# EAGLE schematic BMSBoard (EAGLE 9.1.3)
Steps for Daisy Chaining: Check pins: COMMH+, COMMH-, COMML+, COMML- FAULT_N, FAULTH+, FAULTH-, FAULTL+, FAULTL- VIO _ Connect pins as described.
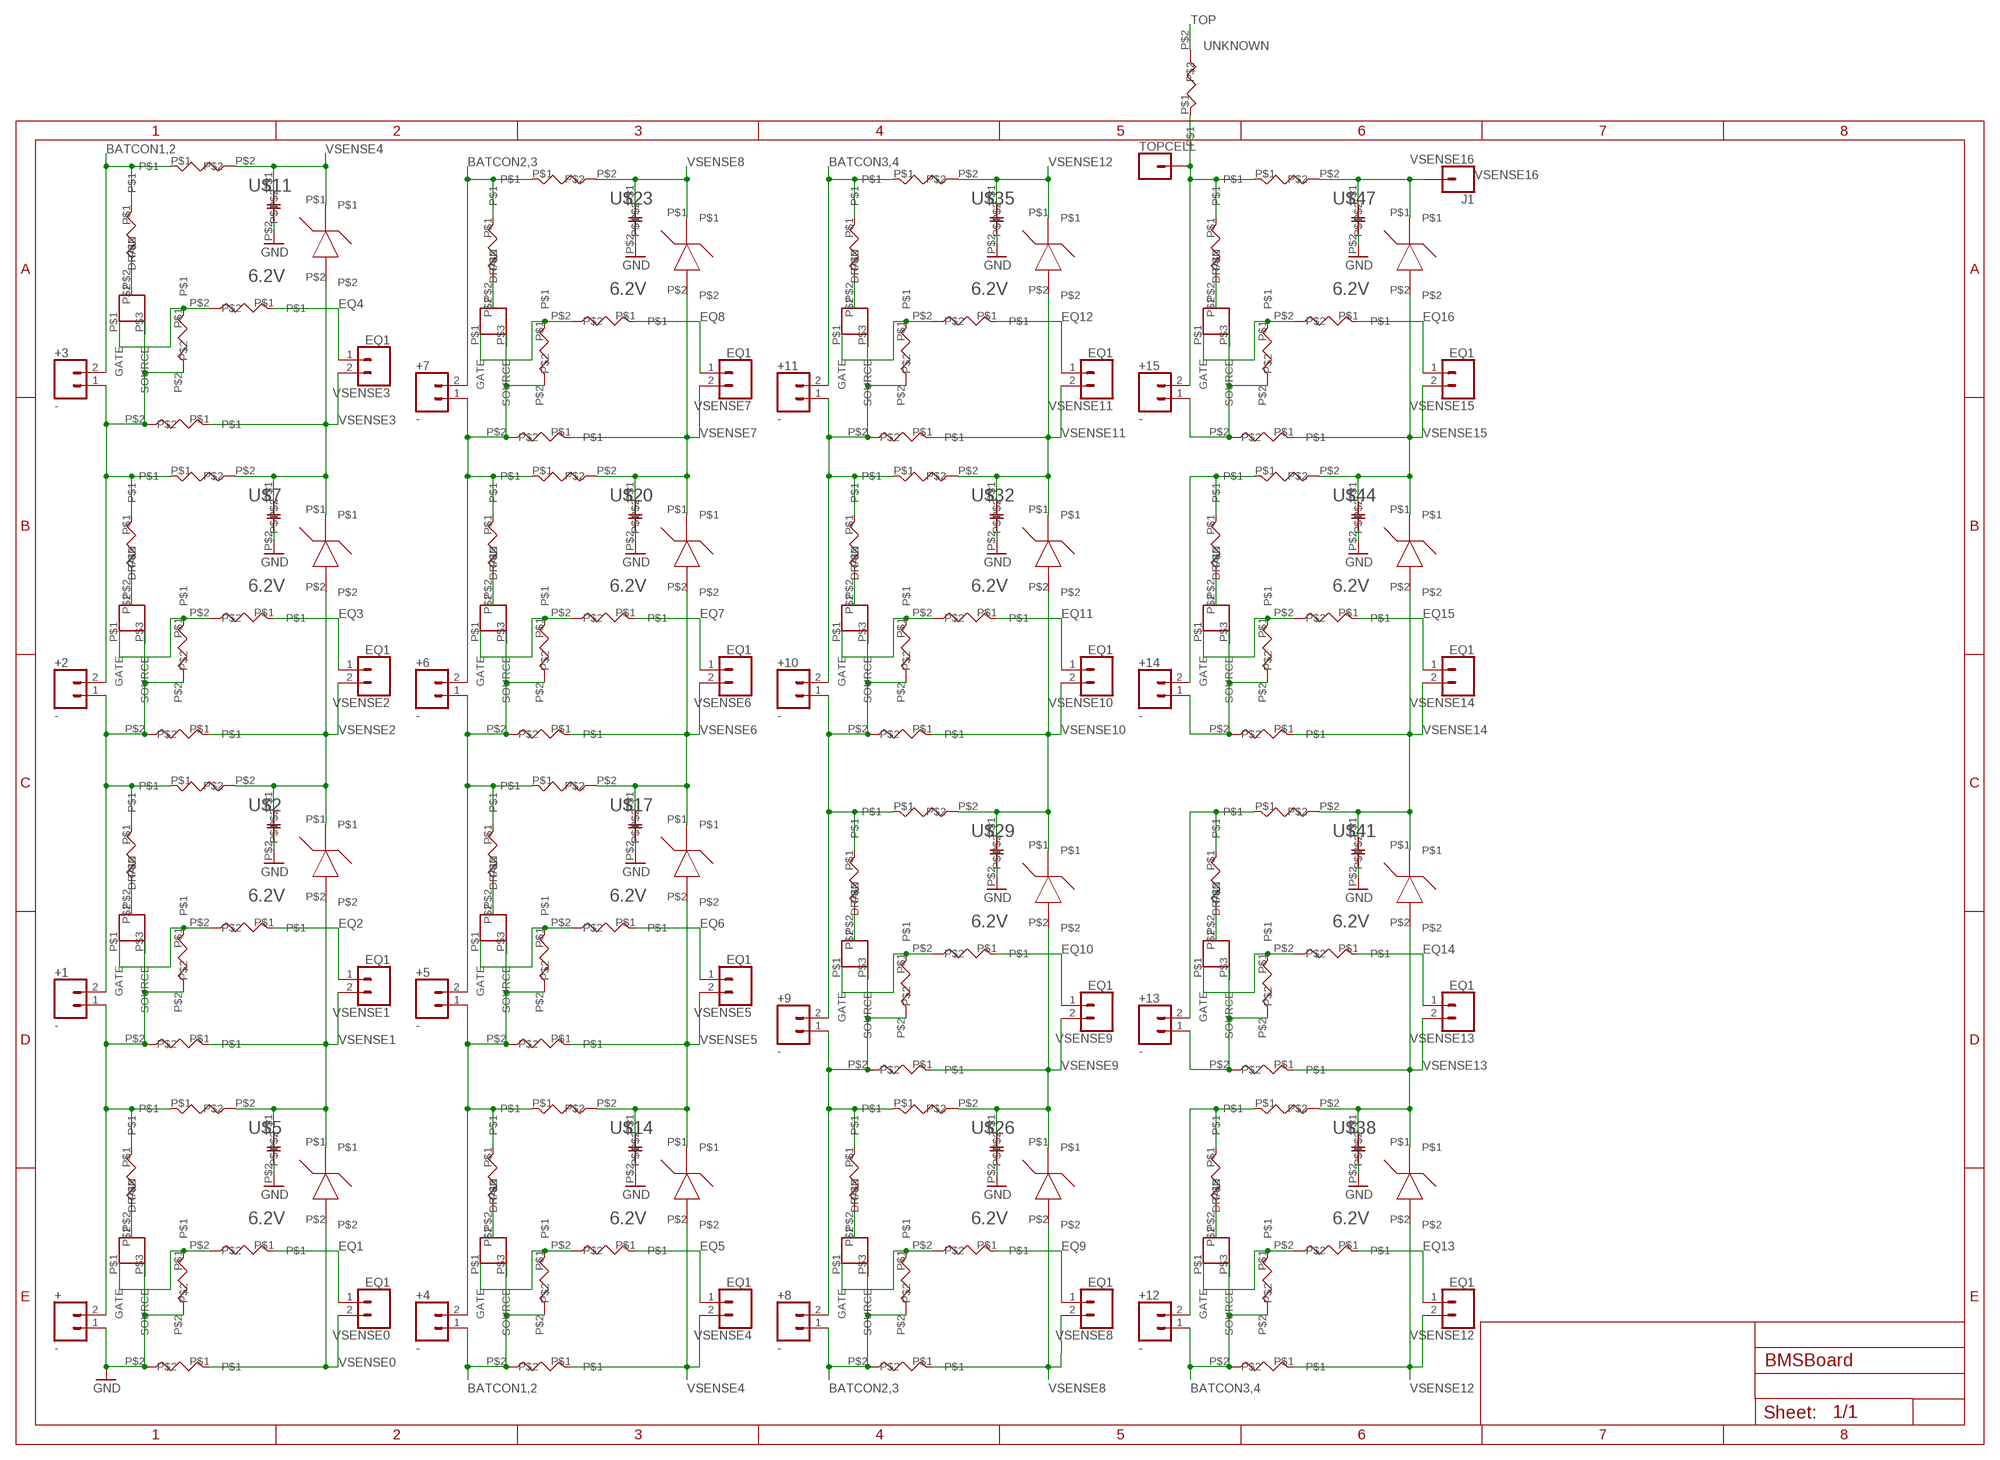
[diagram p0: schematic, sheet 1, part 1 of 2]
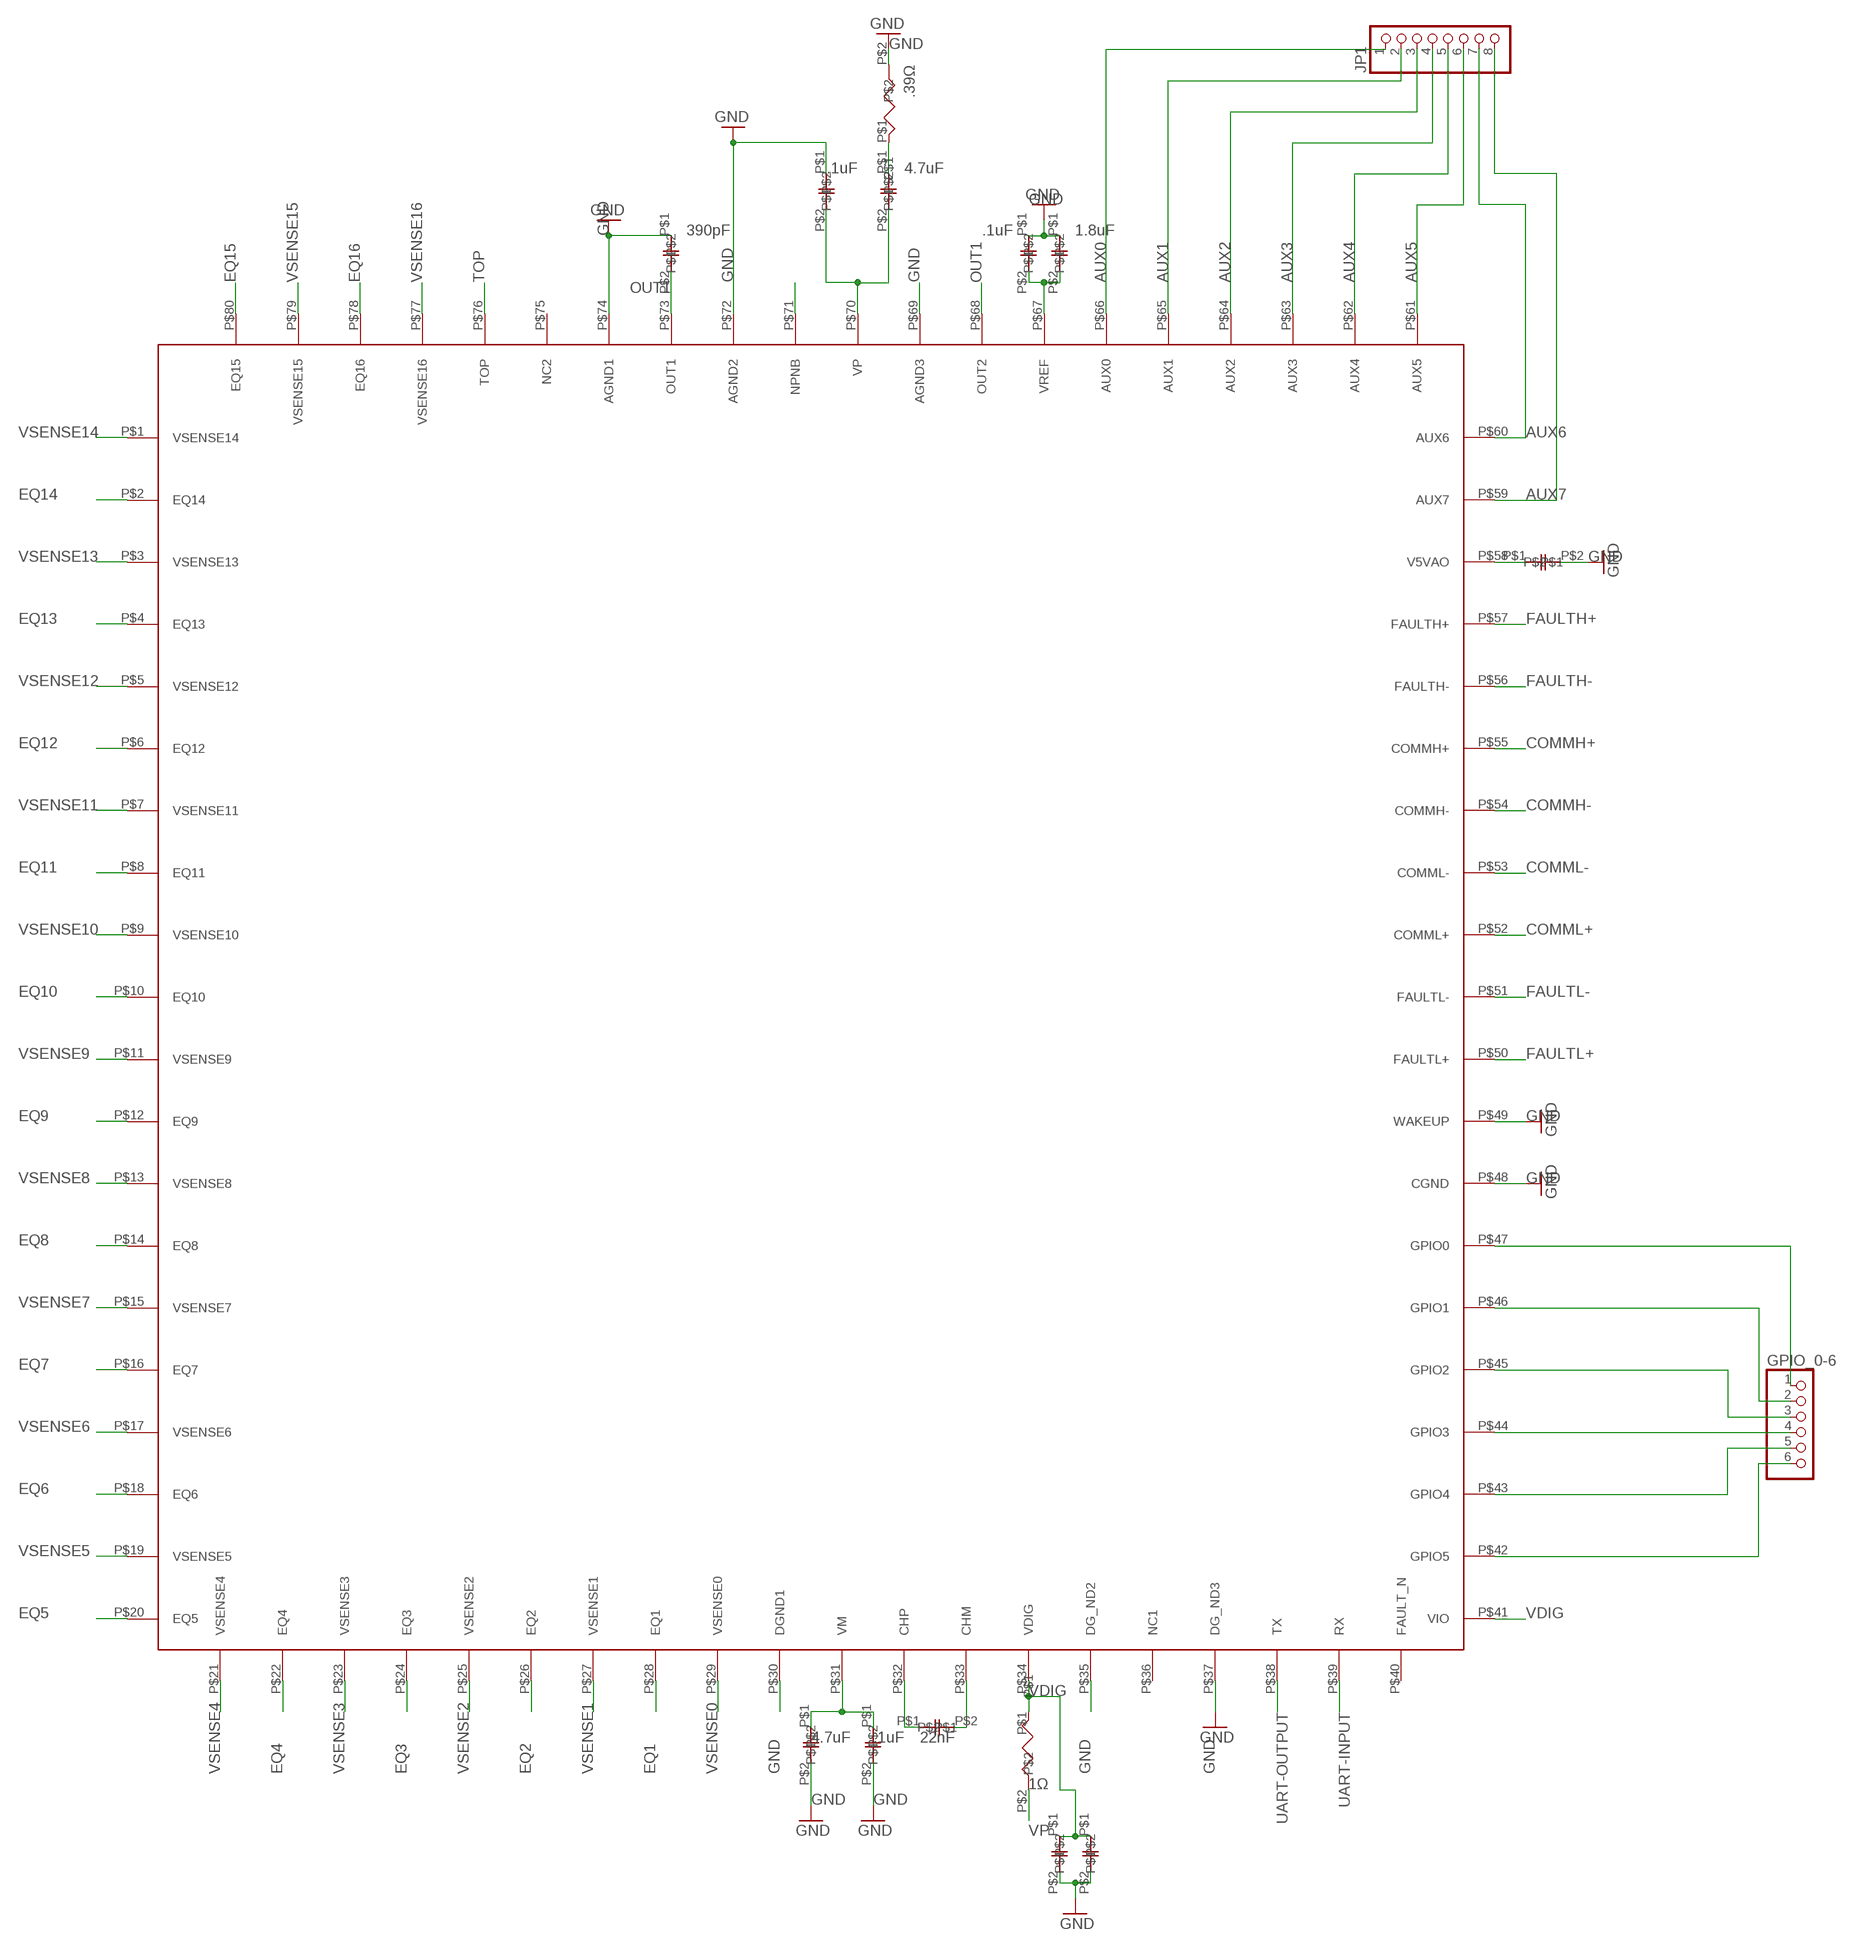
[diagram p1: schematic, sheet 1, part 2 of 2]

## Parts
1UF  1uF  CL21B105KBFNNNG  [CL21B105KBFNNNG]
1UF1  1uF  CL21B105KBFNNNG  [CL21B105KBFNNNG]
1UF2  1uF  CL21B105KBFNNNG  [CL21B105KBFNNNG]
1UF3  1uF  CL21B105KBFNNNG  [CL21B105KBFNNNG]
1UF4  1uF  CL21B105KBFNNNG  [CL21B105KBFNNNG]
1UF5  1uF  CL21B105KBFNNNG  [CL21B105KBFNNNG]
1UF6  1uF  CL21B105KBFNNNG  [CL21B105KBFNNNG]
1UF7  1uF  CL21B105KBFNNNG  [CL21B105KBFNNNG]
1UF8  1uF  CL21B105KBFNNNG  [CL21B105KBFNNNG]
1UF9  1uF  CL21B105KBFNNNG  [CL21B105KBFNNNG]
1UF10  1uF  CL21B105KBFNNNG  [CL21B105KBFNNNG]
1UF11  1uF  CL21B105KBFNNNG  [CL21B105KBFNNNG]
1UF12  1uF  CL21B105KBFNNNG  [CL21B105KBFNNNG]
1UF13  1uF  CL21B105KBFNNNG  [CL21B105KBFNNNG]
1UF14  1uF  CL21B105KBFNNNG  [CL21B105KBFNNNG]
1UF15  1uF  CL21B105KBFNNNG  [CL21B105KBFNNNG]
2KΩ  2kΩ  PWR3014W1000JE  [PWR3014W1000JE]
2KΩ1  2kΩ  PWR3014W1000JE  [PWR3014W1000JE]
2KΩ2  2kΩ  PWR3014W1000JE  [PWR3014W1000JE]
2KΩ3  2kΩ  PWR3014W1000JE  [PWR3014W1000JE]
2KΩ4  2kΩ  PWR3014W1000JE  [PWR3014W1000JE]
2KΩ5  2kΩ  PWR3014W1000JE  [PWR3014W1000JE]
2KΩ6  2kΩ  PWR3014W1000JE  [PWR3014W1000JE]
2KΩ7  2kΩ  PWR3014W1000JE  [PWR3014W1000JE]
2KΩ8  2kΩ  PWR3014W1000JE  [PWR3014W1000JE]
2KΩ9  2kΩ  PWR3014W1000JE  [PWR3014W1000JE]
2KΩ10  2kΩ  PWR3014W1000JE  [PWR3014W1000JE]
2KΩ11  2kΩ  PWR3014W1000JE  [PWR3014W1000JE]
2KΩ12  2kΩ  PWR3014W1000JE  [PWR3014W1000JE]
2KΩ13  2kΩ  PWR3014W1000JE  [PWR3014W1000JE]
2KΩ14  2kΩ  PWR3014W1000JE  [PWR3014W1000JE]
2KΩ15  2kΩ  PWR3014W1000JE  [PWR3014W1000JE]
75Ω  75Ω  PWR3014W1000JE  [PWR3014W1000JE]
75Ω1  75Ω  PWR3014W1000JE  [PWR3014W1000JE]
75Ω2  75Ω  PWR3014W1000JE  [PWR3014W1000JE]
75Ω3  75Ω  PWR3014W1000JE  [PWR3014W1000JE]
75Ω4  75Ω  PWR3014W1000JE  [PWR3014W1000JE]
75Ω5  75Ω  PWR3014W1000JE  [PWR3014W1000JE]
75Ω6  75Ω  PWR3014W1000JE  [PWR3014W1000JE]
75Ω7  75Ω  PWR3014W1000JE  [PWR3014W1000JE]
75Ω8  75Ω  PWR3014W1000JE  [PWR3014W1000JE]
75Ω9  75Ω  PWR3014W1000JE  [PWR3014W1000JE]
75Ω10  75Ω  PWR3014W1000JE  [PWR3014W1000JE]
75Ω11  75Ω  PWR3014W1000JE  [PWR3014W1000JE]
75Ω12  75Ω  PWR3014W1000JE  [PWR3014W1000JE]
75Ω13  75Ω  PWR3014W1000JE  [PWR3014W1000JE]
75Ω14  75Ω  PWR3014W1000JE  [PWR3014W1000JE]
75Ω15  75Ω  PWR3014W1000JE  [PWR3014W1000JE]
100KΩ  100kΩ  PWR3014W1000JE  [PWR3014W1000JE]
100KΩ1  100kΩ  PWR3014W1000JE  [PWR3014W1000JE]
100KΩ2  100kΩ  PWR3014W1000JE  [PWR3014W1000JE]
100KΩ3  100kΩ  PWR3014W1000JE  [PWR3014W1000JE]
100KΩ4  100kΩ  PWR3014W1000JE  [PWR3014W1000JE]
100KΩ5  100kΩ  PWR3014W1000JE  [PWR3014W1000JE]
100KΩ6  100kΩ  PWR3014W1000JE  [PWR3014W1000JE]
100KΩ7  100kΩ  PWR3014W1000JE  [PWR3014W1000JE]
100KΩ8  100kΩ  PWR3014W1000JE  [PWR3014W1000JE]
100KΩ9  100kΩ  PWR3014W1000JE  [PWR3014W1000JE]
100KΩ10  100kΩ  PWR3014W1000JE  [PWR3014W1000JE]
100KΩ11  100kΩ  PWR3014W1000JE  [PWR3014W1000JE]
100KΩ12  100kΩ  PWR3014W1000JE  [PWR3014W1000JE]
100KΩ13  100kΩ  PWR3014W1000JE  [PWR3014W1000JE]
100KΩ14  100kΩ  PWR3014W1000JE  [PWR3014W1000JE]
100KΩ15  100kΩ  PWR3014W1000JE  [PWR3014W1000JE]
100Ω  100Ω  PWR3014W1000JE  [PWR3014W1000JE]
100Ω1  100Ω  PWR3014W1000JE  [PWR3014W1000JE]
100Ω2  100Ω  PWR3014W1000JE  [PWR3014W1000JE]
100Ω3  100Ω  PWR3014W1000JE  [PWR3014W1000JE]
100Ω4  100Ω  PWR3014W1000JE  [PWR3014W1000JE]
100Ω5  100Ω  PWR3014W1000JE  [PWR3014W1000JE]
100Ω6  100Ω  PWR3014W1000JE  [PWR3014W1000JE]
100Ω7  100Ω  PWR3014W1000JE  [PWR3014W1000JE]
100Ω8  100Ω  PWR3014W1000JE  [PWR3014W1000JE]
100Ω9  100Ω  PWR3014W1000JE  [PWR3014W1000JE]
100Ω10  100Ω  PWR3014W1000JE  [PWR3014W1000JE]
100Ω11  100Ω  PWR3014W1000JE  [PWR3014W1000JE]
100Ω12  100Ω  PWR3014W1000JE  [PWR3014W1000JE]
100Ω13  100Ω  PWR3014W1000JE  [PWR3014W1000JE]
100Ω14  100Ω  PWR3014W1000JE  [PWR3014W1000JE]
100Ω15  100Ω  PWR3014W1000JE  [PWR3014W1000JE]
+  -  CONN_02  [1X02]
+1  -  CONN_02  [1X02]
+2  -  CONN_02  [1X02]
+3  -  CONN_02  [1X02]
+4  -  CONN_02  [1X02]
+5  -  CONN_02  [1X02]
+6  -  CONN_02  [1X02]
+7  -  CONN_02  [1X02]
+8  -  CONN_02  [1X02]
+9  -  CONN_02  [1X02]
+10  -  CONN_02  [1X02]
+11  -  CONN_02  [1X02]
+12  -  CONN_02  [1X02]
+13  -  CONN_02  [1X02]
+14  -  CONN_02  [1X02]
+15  -  CONN_02  [1X02]
GPIO_0-6  PINHD-1X6  [1X06]
J1  VSENSE16  CONN_01  [1X01]
JP1  PINHD-1X8BIG  [1X08-BIG]
TOPCELL  CONN_01  [1X01]
U$1  2V7002KT1G  [2V7002KT1G]
U$2  6.2V  PDZ6.2BGWX  [SOD-123-2]
U$3  100Ω  PWR3014W1000JE  [PWR3014W1000JE]
U$4  2V7002KT1G  [2V7002KT1G]
U$5  6.2V  PDZ6.2BGWX  [SOD-123-2]
U$6  2V7002KT1G  [2V7002KT1G]
U$7  6.2V  PDZ6.2BGWX  [SOD-123-2]
U$8  100Ω  PWR3014W1000JE  [PWR3014W1000JE]
U$9  100Ω  PWR3014W1000JE  [PWR3014W1000JE]
U$10  2V7002KT1G  [2V7002KT1G]
U$11  6.2V  PDZ6.2BGWX  [SOD-123-2]
U$12  100Ω  PWR3014W1000JE  [PWR3014W1000JE]
U$13  2V7002KT1G  [2V7002KT1G]
U$14  6.2V  PDZ6.2BGWX  [SOD-123-2]
U$15  100Ω  PWR3014W1000JE  [PWR3014W1000JE]
U$16  2V7002KT1G  [2V7002KT1G]
U$17  6.2V  PDZ6.2BGWX  [SOD-123-2]
U$18  100Ω  PWR3014W1000JE  [PWR3014W1000JE]
U$19  2V7002KT1G  [2V7002KT1G]
U$20  6.2V  PDZ6.2BGWX  [SOD-123-2]
U$21  100Ω  PWR3014W1000JE  [PWR3014W1000JE]
U$22  2V7002KT1G  [2V7002KT1G]
U$23  6.2V  PDZ6.2BGWX  [SOD-123-2]
U$24  100Ω  PWR3014W1000JE  [PWR3014W1000JE]
U$25  2V7002KT1G  [2V7002KT1G]
U$26  6.2V  PDZ6.2BGWX  [SOD-123-2]
U$27  100Ω  PWR3014W1000JE  [PWR3014W1000JE]
U$28  2V7002KT1G  [2V7002KT1G]
U$29  6.2V  PDZ6.2BGWX  [SOD-123-2]
U$30  100Ω  PWR3014W1000JE  [PWR3014W1000JE]
U$31  2V7002KT1G  [2V7002KT1G]
U$32  6.2V  PDZ6.2BGWX  [SOD-123-2]
U$33  100Ω  PWR3014W1000JE  [PWR3014W1000JE]
U$34  2V7002KT1G  [2V7002KT1G]
U$35  6.2V  PDZ6.2BGWX  [SOD-123-2]
U$36  100Ω  PWR3014W1000JE  [PWR3014W1000JE]
U$37  2V7002KT1G  [2V7002KT1G]
U$38  6.2V  PDZ6.2BGWX  [SOD-123-2]
U$39  100Ω  PWR3014W1000JE  [PWR3014W1000JE]
U$40  2V7002KT1G  [2V7002KT1G]
U$41  6.2V  PDZ6.2BGWX  [SOD-123-2]
U$42  100Ω  PWR3014W1000JE  [PWR3014W1000JE]
U$43  2V7002KT1G  [2V7002KT1G]
U$44  6.2V  PDZ6.2BGWX  [SOD-123-2]
U$45  100Ω  PWR3014W1000JE  [PWR3014W1000JE]
U$46  2V7002KT1G  [2V7002KT1G]
U$47  6.2V  PDZ6.2BGWX  [SOD-123-2]
U$48  100Ω  PWR3014W1000JE  [PWR3014W1000JE]
U$49  BQ76PL455A-Q1  [BQ76PL455A-Q1]
U$50  22nF  CL21B105KBFNNNG  [CL21B105KBFNNNG]
U$51  CL21B105KBFNNNG  [CL21B105KBFNNNG]
U$52  CL21B105KBFNNNG  [CL21B105KBFNNNG]
U$53  1Ω  PWR3014W1000JE  [PWR3014W1000JE]
U$54  CL21B105KBFNNNG  [CL21B105KBFNNNG]
U$55  CL21B105KBFNNNG  [CL21B105KBFNNNG]
U$56  CL21B105KBFNNNG  [CL21B105KBFNNNG]
U$57  CL21B105KBFNNNG  [CL21B105KBFNNNG]
U$58  CL21B105KBFNNNG  [CL21B105KBFNNNG]
U$59  CL21B105KBFNNNG  [CL21B105KBFNNNG]
U$60  CL21B105KBFNNNG  [CL21B105KBFNNNG]
U$61  CL21B105KBFNNNG  [CL21B105KBFNNNG]
U$62  PWR3014W1000JE  [PWR3014W1000JE]
U$63  PWR3014W1000JE  [PWR3014W1000JE]
VSENSE0  EQ1  CONN_02  [1X02]
VSENSE1  EQ1  CONN_02  [1X02]
VSENSE2  EQ1  CONN_02  [1X02]
VSENSE3  EQ1  CONN_02  [1X02]
VSENSE4  EQ1  CONN_02  [1X02]
VSENSE5  EQ1  CONN_02  [1X02]
VSENSE6  EQ1  CONN_02  [1X02]
VSENSE7  EQ1  CONN_02  [1X02]
VSENSE8  EQ1  CONN_02  [1X02]
VSENSE9  EQ1  CONN_02  [1X02]
VSENSE10  EQ1  CONN_02  [1X02]
VSENSE11  EQ1  CONN_02  [1X02]
VSENSE12  EQ1  CONN_02  [1X02]
VSENSE13  EQ1  CONN_02  [1X02]
VSENSE14  EQ1  CONN_02  [1X02]
VSENSE15  EQ1  CONN_02  [1X02]

## Nets
AUX0: JP1.1 U$49.P$66(AUX0)
AUX1: JP1.2 U$49.P$65(AUX1)
AUX2: JP1.3 U$49.P$64(AUX2)
AUX3: JP1.4 U$49.P$63(AUX3)
AUX4: JP1.5 U$49.P$62(AUX4)
AUX5: JP1.6 U$49.P$61(AUX5)
AUX6: JP1.7 U$49.P$60(AUX6)
AUX7: JP1.8 U$49.P$59(AUX7)
BATCON1,2: 75Ω3.P$1 100KΩ4.P$2 100Ω4.P$2 +3.2 +4.1 U$12.P$1 U$13.P$3(SOURCE)
BATCON2,3: 75Ω7.P$1 100KΩ8.P$2 100Ω8.P$2 +7.2 +8.1 U$24.P$1 U$25.P$3(SOURCE)
BATCON3,4: 75Ω11.P$1 100KΩ12.P$2 100Ω12.P$2 +11.2 +12.1 U$36.P$1 U$37.P$3(SOURCE)
COMMH+: U$49.P$55(COMMH+)
COMMH-: U$49.P$54(COMMH-)
COMML+: U$49.P$52(COMML+)
COMML-: U$49.P$53(COMML-)
EQ1: 2KΩ.P$1 U$49.P$28(EQ1) VSENSE0.1
EQ2: 2KΩ1.P$1 U$49.P$26(EQ2) VSENSE1.1
EQ3: 2KΩ2.P$1 U$49.P$24(EQ3) VSENSE2.1
EQ4: 2KΩ3.P$1 U$49.P$22(EQ4) VSENSE3.1
EQ5: 2KΩ4.P$1 U$49.P$20(EQ5) VSENSE4.1
EQ6: 2KΩ5.P$1 U$49.P$18(EQ6) VSENSE5.1
EQ7: 2KΩ6.P$1 U$49.P$16(EQ7) VSENSE6.1
EQ8: 2KΩ7.P$1 U$49.P$14(EQ8) VSENSE7.1
EQ9: 2KΩ8.P$1 U$49.P$12(EQ9) VSENSE8.1
EQ10: 2KΩ9.P$1 U$49.P$10(EQ10) VSENSE9.1
EQ11: 2KΩ10.P$1 U$49.P$8(EQ11) VSENSE10.1
EQ12: 2KΩ11.P$1 U$49.P$6(EQ12) VSENSE11.1
EQ13: 2KΩ12.P$1 U$49.P$4(EQ13) VSENSE12.1
EQ14: 2KΩ13.P$1 U$49.P$2(EQ14) VSENSE13.1
EQ15: 2KΩ14.P$1 U$49.P$80(EQ15) VSENSE14.1
EQ16: 2KΩ15.P$1 U$49.P$78(EQ16) VSENSE15.1
FAULTH+: U$49.P$57(FAULTH+)
FAULTH-: U$49.P$56(FAULTH-)
FAULTL+: U$49.P$50(FAULTL+)
FAULTL-: U$49.P$51(FAULTL-)
GND: 1UF1.P$2 1UF2.P$2 1UF3.P$2 1UF4.P$2 1UF5.P$2 1UF6.P$2 1UF7.P$2 1UF8.P$2 1UF9.P$2 1UF10.P$2 1UF11.P$2 1UF12.P$2 1UF13.P$2 1UF14.P$2 1UF15.P$2 1UF.P$2 100KΩ.P$2 100Ω.P$2 +.1 U$4.P$3(SOURCE) U$49.P$30(DGND1) U$49.P$35(DG_ND2) U$49.P$37(DG_ND3) U$49.P$48(CGND) U$49.P$49(WAKEUP) U$49.P$69(AGND3) U$49.P$72(AGND2) U$49.P$74(AGND1) U$51.P$2 U$52.P$2 U$54.P$2 U$55.P$2 U$56.P$2 U$57.P$1 U$58.P$1 U$59.P$1 U$60.P$1 U$62.P$2
N$2: 2KΩ.P$2 100KΩ.P$1 U$4.P$1(GATE)
N$3: U$61.P$1 U$62.P$1
N$4: 75Ω.P$2 U$4.P$2(DRAIN)
N$5: 75Ω.P$1 100KΩ1.P$2 100Ω1.P$2 +1.1 +.2 U$1.P$3(SOURCE) U$8.P$1
N$6: 75Ω2.P$1 100KΩ3.P$2 100Ω3.P$2 +2.2 +3.1 U$9.P$1 U$10.P$3(SOURCE)
N$8: 2KΩ1.P$2 100KΩ1.P$1 U$1.P$1(GATE)
N$10: 75Ω1.P$2 U$1.P$2(DRAIN)
N$11: 75Ω1.P$1 100KΩ2.P$2 100Ω2.P$2 +1.2 +2.1 U$3.P$1 U$6.P$3(SOURCE)
N$14: 2KΩ2.P$2 100KΩ2.P$1 U$6.P$1(GATE)
N$16: 75Ω2.P$2 U$6.P$2(DRAIN)
N$20: 2KΩ3.P$2 100KΩ3.P$1 U$10.P$1(GATE)
N$22: 75Ω3.P$2 U$10.P$2(DRAIN)
N$26: 2KΩ4.P$2 100KΩ4.P$1 U$13.P$1(GATE)
N$28: 75Ω4.P$2 U$13.P$2(DRAIN)
N$32: 2KΩ5.P$2 100KΩ5.P$1 U$16.P$1(GATE)
N$34: 75Ω5.P$2 U$16.P$2(DRAIN)
N$35: 75Ω5.P$1 100KΩ6.P$2 100Ω6.P$2 +5.2 +6.1 U$18.P$1 U$19.P$3(SOURCE)
N$38: 2KΩ6.P$2 100KΩ6.P$1 U$19.P$1(GATE)
N$40: 75Ω6.P$2 U$19.P$2(DRAIN)
N$44: 2KΩ7.P$2 100KΩ7.P$1 U$22.P$1(GATE)
N$46: 75Ω7.P$2 U$22.P$2(DRAIN)
N$50: 2KΩ8.P$2 100KΩ8.P$1 U$25.P$1(GATE)
N$52: 75Ω8.P$2 U$25.P$2(DRAIN)
N$53: 75Ω8.P$1 100KΩ9.P$2 100Ω9.P$2 +8.2 +9.1 U$27.P$1 U$28.P$3(SOURCE)
N$56: 2KΩ9.P$2 100KΩ9.P$1 U$28.P$1(GATE)
N$58: 75Ω9.P$2 U$28.P$2(DRAIN)
N$59: 75Ω9.P$1 100KΩ10.P$2 100Ω10.P$2 +9.2 +10.1 U$30.P$1 U$31.P$3(SOURCE)
N$62: 2KΩ10.P$2 100KΩ10.P$1 U$31.P$1(GATE)
N$64: 75Ω10.P$2 U$31.P$2(DRAIN)
N$68: 2KΩ11.P$2 100KΩ11.P$1 U$34.P$1(GATE)
N$70: 75Ω11.P$2 U$34.P$2(DRAIN)
N$74: 2KΩ12.P$2 100KΩ12.P$1 U$37.P$1(GATE)
N$76: 75Ω12.P$2 U$37.P$2(DRAIN)
N$77: 75Ω12.P$1 +12.2 U$39.P$1
N$80: 2KΩ13.P$2 100KΩ13.P$1 U$40.P$1(GATE)
N$82: 75Ω13.P$2 U$40.P$2(DRAIN)
N$83: 75Ω13.P$1 +13.2 U$42.P$1
N$86: 2KΩ14.P$2 100KΩ14.P$1 U$43.P$1(GATE)
N$88: 75Ω14.P$2 U$43.P$2(DRAIN)
N$89: 75Ω14.P$1 +14.2 U$45.P$1
N$92: 2KΩ15.P$2 100KΩ15.P$1 U$46.P$1(GATE)
N$94: 75Ω15.P$2 U$46.P$2(DRAIN)
N$95: 75Ω15.P$1 +15.2 TOPCELL.1 U$48.P$1 U$63.P$1
N$97: 75Ω4.P$1 100KΩ5.P$2 100Ω5.P$2 +4.2 +5.1 U$15.P$1 U$16.P$3(SOURCE)
N$99: 75Ω6.P$1 100KΩ7.P$2 100Ω7.P$2 +6.2 +7.1 U$21.P$1 U$22.P$3(SOURCE)
N$103: 75Ω10.P$1 100KΩ11.P$2 100Ω11.P$2 +10.2 +11.1 U$33.P$1 U$34.P$3(SOURCE)
N$105: 100KΩ13.P$2 100Ω13.P$2 +13.1 U$40.P$3(SOURCE)
N$106: 100KΩ14.P$2 100Ω14.P$2 +14.1 U$43.P$3(SOURCE)
N$107: 100KΩ15.P$2 100Ω15.P$2 +15.1 U$46.P$3(SOURCE)
N$112: U$49.P$31(VM) U$51.P$1 U$52.P$1
N$113: U$49.P$32(CHP) U$50.P$1
N$114: U$49.P$33(CHM) U$50.P$2
N$123: GPIO_0-6.6 U$49.P$42(GPIO5)
N$124: GPIO_0-6.5 U$49.P$43(GPIO4)
N$125: GPIO_0-6.4 U$49.P$44(GPIO3)
N$126: GPIO_0-6.3 U$49.P$45(GPIO2)
N$127: GPIO_0-6.2 U$49.P$46(GPIO1)
N$128: GPIO_0-6.1 U$49.P$47(GPIO0)
N$139: U$49.P$58(V5VAO) U$56.P$1
N$151: U$49.P$70(VP) U$60.P$2 U$61.P$2
N$152: U$49.P$71(NPNB)
OUT1: U$49.P$68(OUT2) U$49.P$73(OUT1) U$59.P$2
TOP: U$49.P$76(TOP) U$63.P$2
UART-INPUT: U$49.P$39(RX)
UART-OUTPUT: U$49.P$38(TX)
VDIG: U$49.P$34(VDIG) U$49.P$41(VIO) U$53.P$1 U$54.P$1 U$55.P$1
VP: U$53.P$2
VREF: U$49.P$67(VREF) U$57.P$2 U$58.P$2
VSENSE0: 100Ω.P$1 U$5.P$2 U$49.P$29(VSENSE0) VSENSE0.2
VSENSE1: 1UF.P$1 100Ω1.P$1 U$2.P$2 U$5.P$1 U$8.P$2 U$49.P$27(VSENSE1) VSENSE1.2
VSENSE2: 1UF1.P$1 100Ω2.P$1 U$2.P$1 U$3.P$2 U$7.P$2 U$49.P$25(VSENSE2) VSENSE2.2
VSENSE3: 1UF2.P$1 100Ω3.P$1 U$7.P$1 U$9.P$2 U$11.P$2 U$49.P$23(VSENSE3) VSENSE3.2
VSENSE4: 1UF3.P$1 100Ω4.P$1 U$11.P$1 U$12.P$2 U$14.P$2 U$49.P$21(VSENSE4) VSENSE4.2
VSENSE5: 1UF4.P$1 100Ω5.P$1 U$14.P$1 U$15.P$2 U$17.P$2 U$49.P$19(VSENSE5) VSENSE5.2
VSENSE6: 1UF5.P$1 100Ω6.P$1 U$17.P$1 U$18.P$2 U$20.P$2 U$49.P$17(VSENSE6) VSENSE6.2
VSENSE7: 1UF6.P$1 100Ω7.P$1 U$20.P$1 U$21.P$2 U$23.P$2 U$49.P$15(VSENSE7) VSENSE7.2
VSENSE8: 1UF7.P$1 100Ω8.P$1 U$23.P$1 U$24.P$2 U$26.P$2 U$49.P$13(VSENSE8) VSENSE8.2
VSENSE9: 1UF8.P$1 100Ω9.P$1 U$26.P$1 U$27.P$2 U$29.P$2 U$49.P$11(VSENSE9) VSENSE9.2
VSENSE10: 1UF9.P$1 100Ω10.P$1 U$29.P$1 U$30.P$2 U$32.P$2 U$49.P$9(VSENSE10) VSENSE10.2
VSENSE11: 1UF10.P$1 100Ω11.P$1 U$32.P$1 U$33.P$2 U$35.P$2 U$49.P$7(VSENSE11) VSENSE11.2
VSENSE12: 1UF11.P$1 100Ω12.P$1 U$35.P$1 U$36.P$2 U$38.P$2 U$49.P$5(VSENSE12) VSENSE12.2
VSENSE13: 1UF12.P$1 100Ω13.P$1 U$38.P$1 U$39.P$2 U$41.P$2 U$49.P$3(VSENSE13) VSENSE13.2
VSENSE14: 1UF13.P$1 100Ω14.P$1 U$41.P$1 U$42.P$2 U$44.P$2 U$49.P$1(VSENSE14) VSENSE14.2
VSENSE15: 1UF14.P$1 100Ω15.P$1 U$44.P$1 U$45.P$2 U$47.P$2 U$49.P$79(VSENSE15) VSENSE15.2
VSENSE16: 1UF15.P$1 J1.1 U$47.P$1 U$48.P$2 U$49.P$77(VSENSE16)
Unconnected: U$49.P$36(NC1) U$49.P$40(FAULT_N) U$49.P$75(NC2)

## Library data of the parts
1UF 1UF1-1UF15 U$54-U$56 = Pod4:CL21B105KBFNNNG
2KΩ 2KΩ1-2KΩ15 75Ω 75Ω1-75Ω15 100KΩ 100KΩ1-100KΩ15 100Ω 100Ω1-100Ω15 U$3 U$8 U$9 U$12 U$15 U$18 U$21 U$24 U$27 U$30 U$33 U$36 U$39 U$42 U$45 U$48 = Pod4:PWR3014W1000JE
+ +1-+15 VSENSE0 VSENSE1-VSENSE14 = SparkFun-Connectors:CONN_02: Multi connection point. Often used as Generic Header-pin footprint for 0.1 inch spaced/style header connections On any of the 0.1 inch spaced packages, you can populate with these: Break Away Headers - Straight <https://www.sparkfun.com/products/116> (PRT-00116) Break Away Male Headers - Right Angle <https://www.sparkfun.com/products/553> (PRT-00553) Female Headers <https://www.sparkfun.com/products/115> (PRT-00115) Break Away Headers - Machine Pin <https://www.sparkfun.com/products/117> (PRT-00117) Break Away Female Headers - Swiss Machine Pin <https://www.sparkfun.com/products/743> (PRT-00743) For SCREWTERMINALS and SPRING TERMINALS visit here: Screw Terimnals on SparkFun.com <https://www.sparkfun.com/search/results?term=Screw+Terminals> (5mm/3.5mm/2.54mm spacing) This device is also useful as a general connection point to wire up your design to another part of your project. Our various solder wires solder well into these plated through hole pads. Hook-Up Wire - Assortment (Stranded, 22 AWG) <https://www.sparkfun.com/products/11375> (PRT-11375) Hook-Up Wire - Assortment (Solid Core, 22 AWG) <https://www.sparkfun.com/products/11367> (PRT-11367) View the entire wire category on our website here <https://www.sparkfun.com/categories/141> Special notes: Molex polarized connector foot print use with: PRT-08233 with associated crimp pins and housings. 2.54_SCREWTERM for use with PRT-10571. 3.5mm Screw Terminal footprints for PRT-08084 5mm Screw Terminal footprints for use with PRT-08432
GPIO_0-6 = adafruit:PINHD-1X6: PIN HEADER
J1 TOPCELL = SparkFun-Connectors:CONN_01: Single connection point. Often used as Generic Header-pin footprint for 0.1 inch spaced/style header connections On any of the 0.1 inch spaced packages, you can populate with these: Break Away Headers - Straight <https://www.sparkfun.com/products/116> (PRT-00116) Break Away Male Headers - Right Angle <https://www.sparkfun.com/products/553> (PRT-00553) Female Headers <https://www.sparkfun.com/products/115> (PRT-00115) Break Away Headers - Machine Pin <https://www.sparkfun.com/products/117> (PRT-00117) Break Away Female Headers - Swiss Machine Pin <https://www.sparkfun.com/products/743> (PRT-00743) This device is also useful as a general connection point to wire up your design to another part of your project. Our various solder wires solder well into these plated through hole pads. Hook-Up Wire - Assortment (Stranded, 22 AWG) <https://www.sparkfun.com/products/11375> (PRT-11375) Hook-Up Wire - Assortment (Solid Core, 22 AWG) <https://www.sparkfun.com/products/11367> (PRT-11367) View the entire wire category on our website here <https://www.sparkfun.com/categories/141> Special notes: SMTSO-256-ET is a "flush mount" nut for a 4-40 screw. We mostly use this on specialty testbeds; it is a nice way to connect hardware to your PCB at an adjustable hieght. Also note, the SNAP packages are for using a snappable style connector. We sell a baggie of snaps and they are also used on two LilyPad designs: Snap Assortment - 30 pack (male and female) <https://www.sparkfun.com/products/11347> (DEV-11347) LilyPad Arduino SimpleSnap <https://www.sparkfun.com/products/10941> (DEV-10941) LilyPad SimpleSnap Protoboard <https://www.sparkfun.com/products/10940> (DEV-10940)
JP1 = adafruit:PINHD-1X8: PIN HEADER
U$1 U$4 U$6 U$10 U$13 U$16 U$19 U$22 U$25 U$28 U$31 U$34 U$37 U$40 U$43 U$46 = Pod4:2V7002KT1G: Price: $.32 Max. Dimensions: 2.90 mm x 2.40 mm 60V DSS; 20V GS Datasheet: https://www.onsemi.com/pub/Collateral/2N7002K-D.PDF
U$2 U$5 U$7 U$11 U$14 U$17 U$20 U$23 U$26 U$29 U$32 U$35 U$38 U$41 U$44 U$47 = Pod4:PDZ6.2BGWX: PDZ6.2BGWX 6.2V 625 mV zener diode
U$49 = Pod4:BQ76PL455A-Q1: bq76PL455A-Q1 16-Cell EV/HEV Integrated Battery Monitor and Protector
U$50 = Pod4:CL21B105KBFNNNG; CHP-CHM: 22nF
U$51 = Pod4:CL21B105KBFNNNG; VMCAP1: 4.7uF
U$52 = Pod4:CL21B105KBFNNNG; VMCAP2: .1uF
U$53 = Pod4:PWR3014W1000JE; VDIG-VP-RESIST: 1Ω
U$57 = Pod4:CL21B105KBFNNNG; VREFCAP1: .1uF
U$58 = Pod4:CL21B105KBFNNNG; VREFCAP2: 1.8uF
U$59 = Pod4:CL21B105KBFNNNG; OUT-CAP: 390pF
U$60 = Pod4:CL21B105KBFNNNG; VP-AGND-CAP: .1uF
U$61 = Pod4:CL21B105KBFNNNG; VP-GND-CAP: 4.7uF
U$62 = Pod4:PWR3014W1000JE; VP-RESIST: .39Ω
U$63 = Pod4:PWR3014W1000JE; TOP-RESIST: UNKNOWN
VSENSE15 = SparkFun-Connectors:CONN_02: Multi connection point. Often used as Generic Header-pin footprint for 0.1 inch spaced/style header connections On any of the 0.1 inch spaced packages, you can populate with these: Break Away Headers - Straight <https://www.sparkfun.com/products/116> (PRT-00116) Break Away Male Headers - Right Angle <https://www.sparkfun.com/products/553> (PRT-00553) Female Headers <https://www.sparkfun.com/products/115> (PRT-00115) Break Away Headers - Machine Pin <https://www.sparkfun.com/products/117> (PRT-00117) Break Away Female Headers - Swiss Machine Pin <https://www.sparkfun.com/products/743> (PRT-00743) For SCREWTERMINALS and SPRING TERMINALS visit here: Screw Terimnals on SparkFun.com <https://www.sparkfun.com/search/results?term=Screw+Terminals> (5mm/3.5mm/2.54mm spacing) This device is also useful as a general connection point to wire up your design to another part of your project. Our various solder wires solder well into these plated through hole pads. Hook-Up Wire - Assortment (Stranded, 22 AWG) <https://www.sparkfun.com/products/11375> (PRT-11375) Hook-Up Wire - Assortment (Solid Core, 22 AWG) <https://www.sparkfun.com/products/11367> (PRT-11367) View the entire wire category on our website here <https://www.sparkfun.com/categories/141> Special notes: Molex polarized connector foot print use with: PRT-08233 with associated crimp pins and housings. 2.54_SCREWTERM for use with PRT-10571. 3.5mm Screw Terminal footprints for PRT-08084 5mm Screw Terminal footprints for use with PRT-08432; SPICEPREFIX: I